# Altium schematic sheet SAM_E54_Xplained_Pro_Connectors.SchDoc: Extension connectors
size A3; Organization: Microchip Norway; Address1: Vestre Rosten 79; Address2: N-7075 TILLER; Address3: NORWAY; DocumentNumber: A09-2748; Revision: 5; SheetNumber: 5; SheetTotal: 13; DrawnBy: Microchip Norway; Engineer: HN; PageSetup: Record=PageOptions|CenterHorizontal=True|CenterVertical=True|PrintScale=1.01|XCorrection=1.00|YCorrection=1.00|PrintKind=1|BorderSize=5000000|LeftOffset=0|BottomOffset=0|Orientation=2|PaperLength=1000|PaperWidth=1000|Scale=100|PaperSource=7|PrintQuality=-4|MediaType=1|DitherType=10|PaperKind=A3 (297 x 420 mm)|PrintScaleMode=1; ProjectTitle: SAM E54 Xplained Pro; PCBNumber: A08-2643; PCBRevision: 3; ProjectName: SAM E54 Xplained Pro
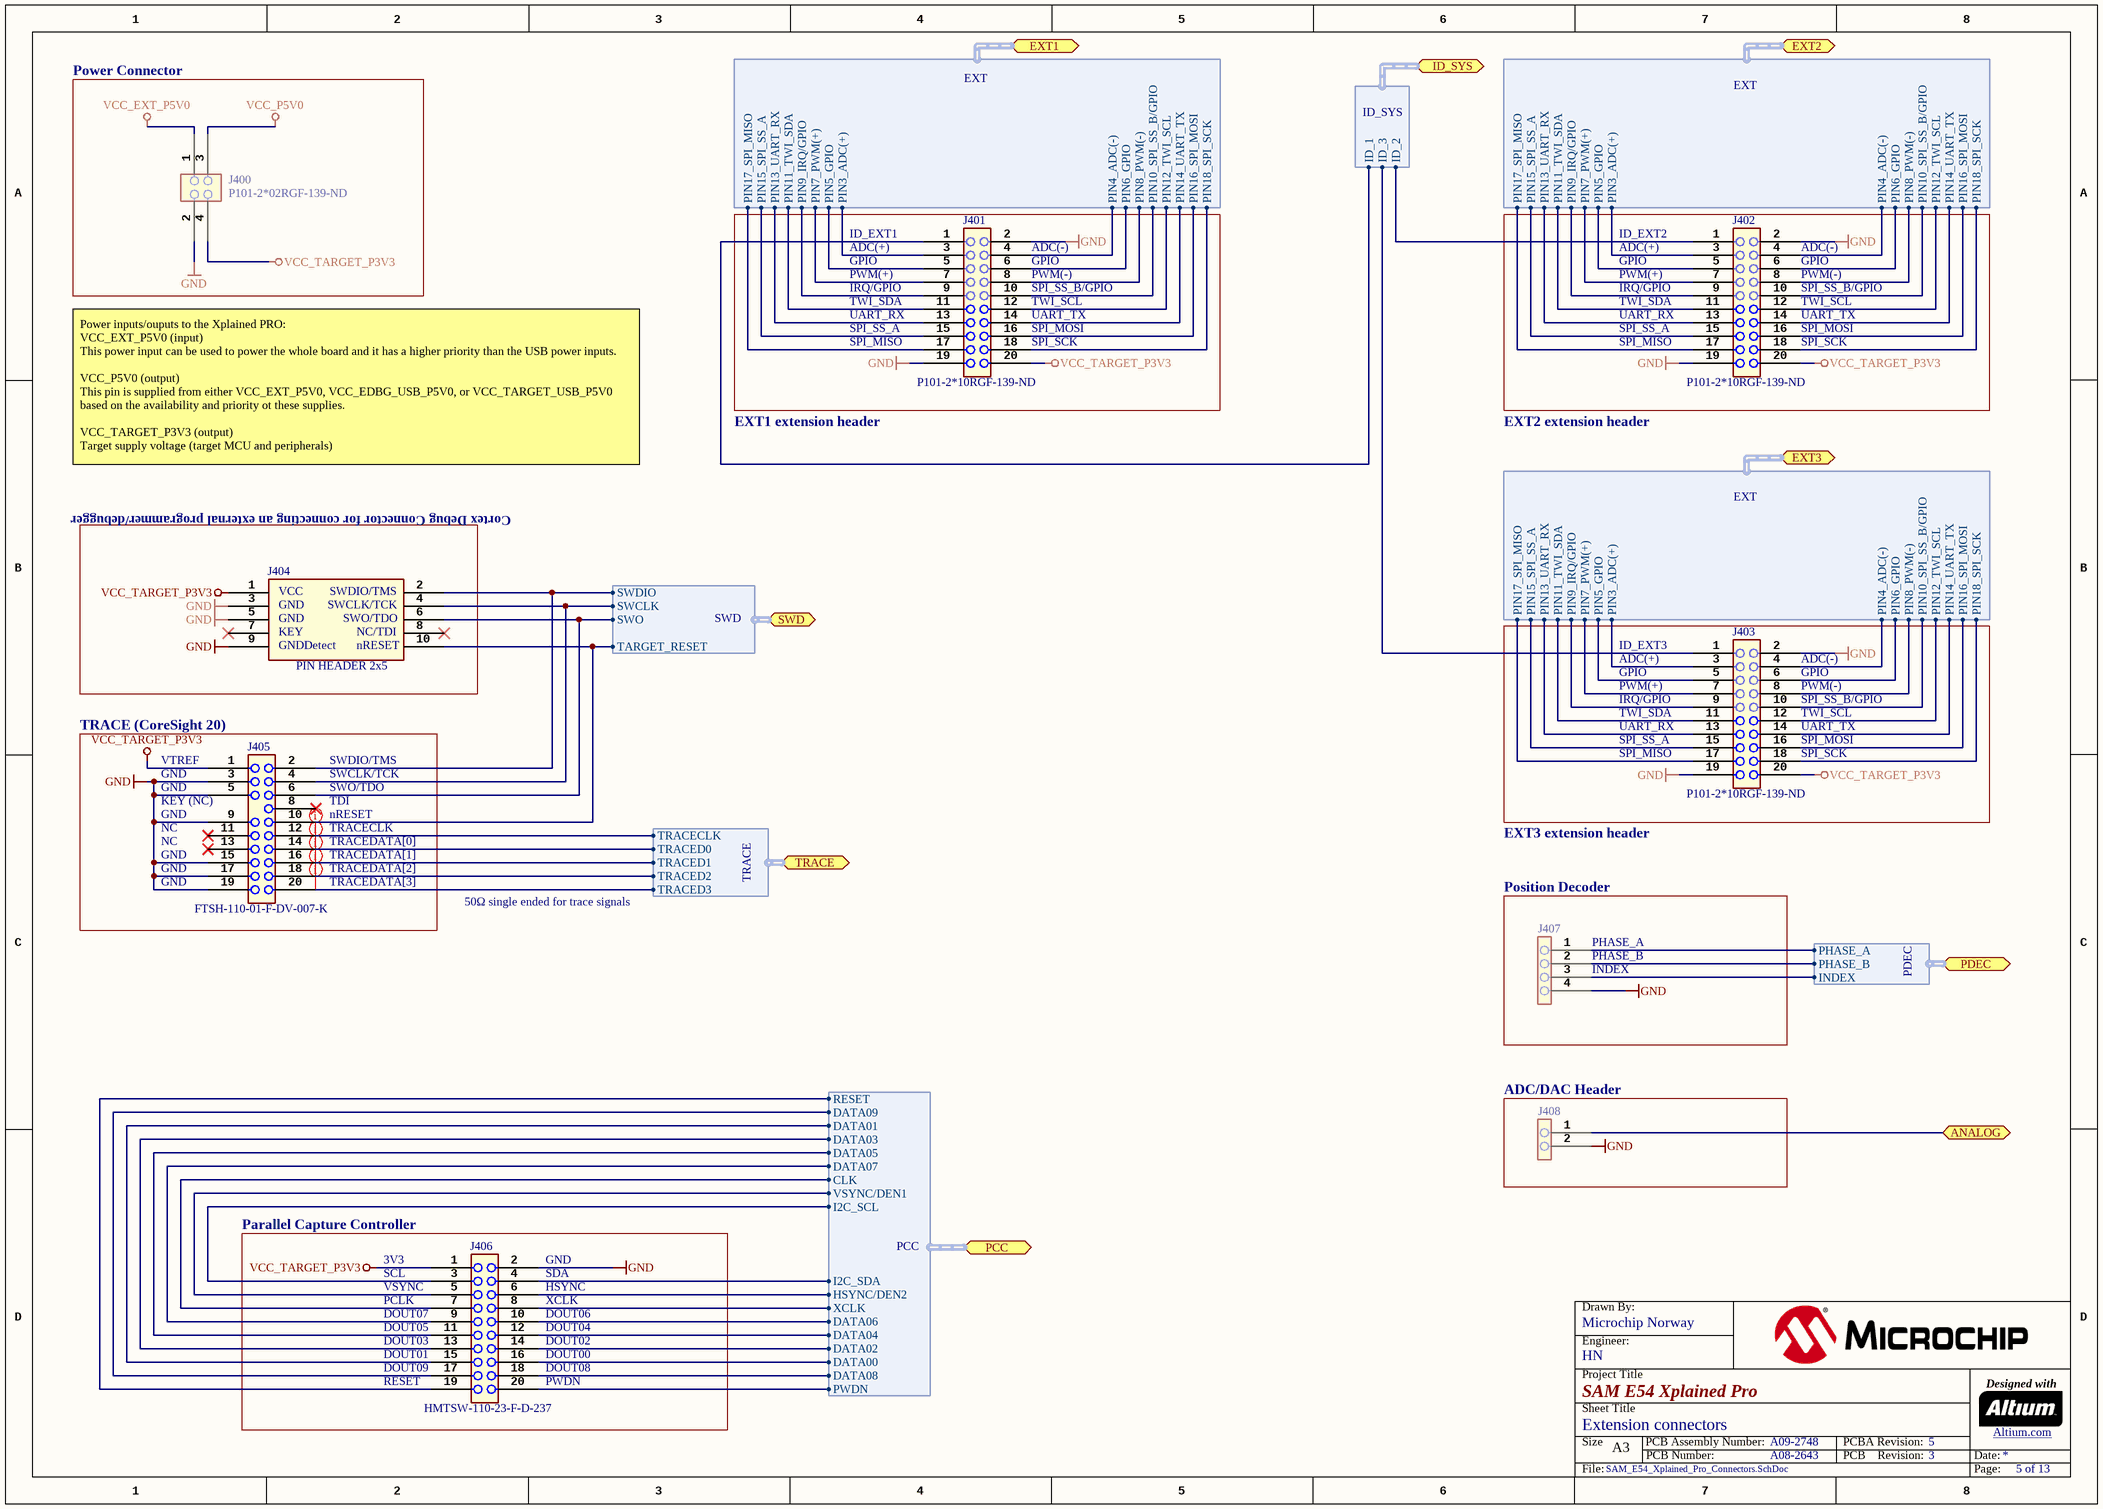
[diagram p0: SAM_E54_Xplained_Pro_Connectors.SchDoc]

## Parts
J400  value P101-2*02RGF-139-ND  [AP8-00628]
J401  value P101-2*10RGF-139-ND  [AP8-00622]
J402  value P101-2*10RGF-139-ND  [AP8-00622]
J403  value P101-2*10RGF-139-ND  [AP8-00622]
J404  value PIN HEADER 2x5  [AP8-00257]
J405  value FTSH-110-01-F-DV-007-K  [AP8-00910]
J406  value HMTSW-110-23-F-D-237  [AP8-00744]
J407  (no value)  [AP8-00176]
J408  (no value)  [AP8-00733]

## Blocks framed on the sheet
Power Connector: J400
TRACE (CoreSight 20): J405
Position Decoder: J407
ADC/DAC Header: J408
Parallel Capture Controller: J406

## Ports
ANALOG (bidir), EXT1 (harness EXT), EXT2 (harness EXT), EXT3 (harness EXT), ID_SYS (harness ID_SYS), PCC (harness PCC), PDEC (harness PDEC), SWD (harness SWD), TRACE (harness TRACE)

## Harnesses
ID_SYS: ID_1, ID_3, ID_2
EXT: PIN3_ADC(+), PIN4_ADC(-), PIN5_GPIO, PIN6_GPIO, PIN7_PWM(+), PIN8_PWM(-), PIN9_IRQ/GPIO, PIN10_SPI_SS_B/GPIO, PIN11_TWI_SDA, PIN12_TWI_SCL, PIN13_UART_RX, PIN14_UART_TX, PIN15_SPI_SS_A, PIN16_SPI_MOSI, PIN17_SPI_MISO, PIN18_SPI_SCK
TRACE: TRACECLK, TRACED0, TRACED1, TRACED2, TRACED3
SWD: SWCLK, SWDIO, TARGET_RESET, SWO
PCC: CLK, DATA00, DATA01, DATA02, DATA03, DATA04, DATA05, DATA06, DATA07, DATA08, DATA09, HSYNC/DEN2, I2C_SCL, I2C_SDA, PWDN, RESET, VSYNC/DEN1, XCLK
PDEC: PHASE_A, PHASE_B, INDEX

## Nets
GND: J400.2 J401.2 J401.19 J402.2 J402.19 J403.2 J403.19 J404.3 J404.5 J404.9 J405.3 J405.5 J405.9 J405.15 J405.17 J405.19 J406.2 J407.4 J408.2
VCC_EXT_P5V0: J400.1
VCC_P5V0: J400.3
VCC_TARGET_P3V3: J400.4 J401.20 J402.20 J403.20 J404.1 J405.1 J406.1
ANALOG: J408.1 ; port ANALOG
NetJ401_1: J401.1 ; port ID_SYS.ID_1
NetJ401_3: J401.3 ; port EXT1.PIN3_ADC(+)
NetJ401_4: J401.4 ; port EXT1.PIN4_ADC(-)
NetJ401_5: J401.5 ; port EXT1.PIN5_GPIO
NetJ401_6: J401.6 ; port EXT1.PIN6_GPIO
NetJ401_7: J401.7 ; port EXT1.PIN7_PWM(+)
NetJ401_8: J401.8 ; port EXT1.PIN8_PWM(-)
NetJ401_9: J401.9 ; port EXT1.PIN9_IRQ/GPIO
NetJ401_10: J401.10 ; port EXT1.PIN10_SPI_SS_B/GPIO
NetJ401_11: J401.11 ; port EXT1.PIN11_TWI_SDA
NetJ401_12: J401.12 ; port EXT1.PIN12_TWI_SCL
NetJ401_13: J401.13 ; port EXT1.PIN13_UART_RX
NetJ401_14: J401.14 ; port EXT1.PIN14_UART_TX
NetJ401_15: J401.15 ; port EXT1.PIN15_SPI_SS_A
NetJ401_16: J401.16 ; port EXT1.PIN16_SPI_MOSI
NetJ401_17: J401.17 ; port EXT1.PIN17_SPI_MISO
NetJ401_18: J401.18 ; port EXT1.PIN18_SPI_SCK
NetJ402_1: J402.1 ; port ID_SYS.ID_2
NetJ402_3: J402.3 ; port EXT2.PIN3_ADC(+)
NetJ402_4: J402.4 ; port EXT2.PIN4_ADC(-)
NetJ402_5: J402.5 ; port EXT2.PIN5_GPIO
NetJ402_6: J402.6 ; port EXT2.PIN6_GPIO
NetJ402_7: J402.7 ; port EXT2.PIN7_PWM(+)
NetJ402_8: J402.8 ; port EXT2.PIN8_PWM(-)
NetJ402_9: J402.9 ; port EXT2.PIN9_IRQ/GPIO
NetJ402_10: J402.10 ; port EXT2.PIN10_SPI_SS_B/GPIO
NetJ402_11: J402.11 ; port EXT2.PIN11_TWI_SDA
NetJ402_12: J402.12 ; port EXT2.PIN12_TWI_SCL
NetJ402_13: J402.13 ; port EXT2.PIN13_UART_RX
NetJ402_14: J402.14 ; port EXT2.PIN14_UART_TX
NetJ402_15: J402.15 ; port EXT2.PIN15_SPI_SS_A
NetJ402_16: J402.16 ; port EXT2.PIN16_SPI_MOSI
NetJ402_17: J402.17 ; port EXT2.PIN17_SPI_MISO
NetJ402_18: J402.18 ; port EXT2.PIN18_SPI_SCK
NetJ403_1: J403.1 ; port ID_SYS.ID_3
NetJ403_3: J403.3 ; port EXT3.PIN3_ADC(+)
NetJ403_4: J403.4 ; port EXT3.PIN4_ADC(-)
NetJ403_5: J403.5 ; port EXT3.PIN5_GPIO
NetJ403_6: J403.6 ; port EXT3.PIN6_GPIO
NetJ403_7: J403.7 ; port EXT3.PIN7_PWM(+)
NetJ403_8: J403.8 ; port EXT3.PIN8_PWM(-)
NetJ403_9: J403.9 ; port EXT3.PIN9_IRQ/GPIO
NetJ403_10: J403.10 ; port EXT3.PIN10_SPI_SS_B/GPIO
NetJ403_11: J403.11 ; port EXT3.PIN11_TWI_SDA
NetJ403_12: J403.12 ; port EXT3.PIN12_TWI_SCL
NetJ403_13: J403.13 ; port EXT3.PIN13_UART_RX
NetJ403_14: J403.14 ; port EXT3.PIN14_UART_TX
NetJ403_15: J403.15 ; port EXT3.PIN15_SPI_SS_A
NetJ403_16: J403.16 ; port EXT3.PIN16_SPI_MOSI
NetJ403_17: J403.17 ; port EXT3.PIN17_SPI_MISO
NetJ403_18: J403.18 ; port EXT3.PIN18_SPI_SCK
NetJ404_2: J404.2 J405.2 ; port SWD.SWDIO
NetJ404_4: J404.4 J405.4 ; port SWD.SWCLK
NetJ404_6: J404.6 J405.6 ; port SWD.SWO
NetJ404_10: J404.10 J405.10 ; port SWD.TARGET_RESET
NetJ405_12: J405.12 ; port TRACE.TRACECLK
NetJ405_14: J405.14 ; port TRACE.TRACED0
NetJ405_16: J405.16 ; port TRACE.TRACED1
NetJ405_18: J405.18 ; port TRACE.TRACED2
NetJ405_20: J405.20 ; port TRACE.TRACED3
NetJ406_3: J406.3 ; port PCC.I2C_SCL
NetJ406_4: J406.4 ; port PCC.I2C_SDA
NetJ406_5: J406.5 ; port PCC.VSYNC/DEN1
NetJ406_6: J406.6 ; port PCC.HSYNC/DEN2
NetJ406_7: J406.7 ; port PCC.CLK
NetJ406_8: J406.8 ; port PCC.XCLK
NetJ406_9: J406.9 ; port PCC.DATA07
NetJ406_10: J406.10 ; port PCC.DATA06
NetJ406_11: J406.11 ; port PCC.DATA05
NetJ406_12: J406.12 ; port PCC.DATA04
NetJ406_13: J406.13 ; port PCC.DATA03
NetJ406_14: J406.14 ; port PCC.DATA02
NetJ406_15: J406.15 ; port PCC.DATA01
NetJ406_16: J406.16 ; port PCC.DATA00
NetJ406_17: J406.17 ; port PCC.DATA09
NetJ406_18: J406.18 ; port PCC.DATA08
NetJ406_19: J406.19 ; port PCC.RESET
NetJ406_20: J406.20 ; port PCC.PWDN
NetJ407_1: J407.1 ; port PDEC.PHASE_A
NetJ407_2: J407.2 ; port PDEC.PHASE_B
NetJ407_3: J407.3 ; port PDEC.INDEX

Not connected (* = marked no-connect by the designer): J404 7* 8*; J405 8* 11* 13*

## Layout directives
net class TRACE: NetJ405_12, NetJ405_14, NetJ405_16, NetJ405_18, NetJ405_20

## Notes on the sheet
- ID_EXT1
- ID_EXT2
- ADC(+)
- GPIO
- PWM(+)
- IRQ/GPIO
- TWI_SDA
- UART_RX
- (near J401) ADC(-)
- (near J401) GPIO
- (near J401) PWM(-)
- (near J401) SPI_SS_B/GPIO
- (near J401) TWI_SCL
- (near J401) UART_TX
- (near J402) ADC(-)
- (near J402) GPIO
- (near J402) PWM(-)
- (near J402) SPI_SS_B/GPIO
- (near J402) TWI_SCL
- (near J402) UART_TX
- SPI_SS_A
- SPI_MISO
- (near J401) SPI_MOSI
- (near J401) SPI_SCK
- (near J402) SPI_MOSI
- (near J402) SPI_SCK
- EXT1 extension header
- EXT2 extension header
- Power inputs/ouputs to the Xplained PRO:
  VCC_EXT_P5V0 (input)
  This power input can be used to power the whole board and it has a higher priority than the USB power inputs.
  VCC_P5V0 (output)
  This pin is supplied from either VCC_EXT_P5V0, VCC_EDBG_USB_P5V0, or VCC_TARGET_USB_P5V0 based on the availability and priority ot these supplies.
  VCC_TARGET_P3V3 (output)
  Target supply voltage (target MCU and peripherals)
- Cortex Debug Connector for connecting an external programmer/debugger
- ID_EXT3
- (near J403) ADC(-)
- (near J403) GPIO
- (near J403) PWM(-)
- (near J403) SPI_SS_B/GPIO
- (near J403) TWI_SCL
- VTREF
- GND
- SWDIO/TMS
- SWCLK/TCK
- (near J403) UART_TX
- (near J403) SPI_MOSI
- (near J403) SPI_SCK
- (near J405) KEY (NC)
- NC
- TRACEDATA[1]
- TDI
- SWO/TDO
- nRESET
- TRACEDATA[0]
- TRACECLK
- EXT3 extension header
- TRACEDATA[2]
- TRACEDATA[3]
- 50Ω single ended for trace signals
- (near J407) PHASE_A
- (near J407) PHASE_B
- (near J407) INDEX
- 3V3
- (near J406) GND
- SCL
- VSYNC
- PCLK
- (near J406) DOUT07
- (near J406) HSYNC
- (near J406) SDA
- (near J406) XCLK
- (near J406) DOUT06
- (near J406) DOUT01
- (near J406) DOUT03
- (near J406) DOUT05
- (near J406) DOUT09
- RESET
- (near J406) DOUT00
- (near J406) DOUT02
- (near J406) DOUT04
- (near J406) DOUT08
- (near J406) PWDN
- Drawn By:
- Project Title
- Engineer:
- Designed with
- Sheet Title
- Size
- A3
- PCB Number:
- PCB Assembly Number:
- PCBA Revision:
- PCB    Revision:
- Date:
- Altium.com <http://go.altium.com/MicrochipLandingPage_Evaluation.html>
- File:
- Page:
- (in symbol A08-0385) VCC; SWDIO/TMS; GND; SWCLK/TCK; SWO/TDO; KEY; NC/TDI; GNDDetect; nRESET

## Library data of the parts
J400 = A08-1519: Pin header, 2x2, Right Angle, 2.54mm, THT, Pin In Paste; PartGroup: Mechanical devices,Connectors,Pin headers; Manufacturer: Pro-data International Corp; AN: A08-1519; Height: 5,07999992370605; MPN: P101-2*02RGF-139-ND
J401-J403 = A08-1513: Pin header, 2x10, Right Angle, 2.54mm, THM, Pin In Paste; PartGroup: Mechanical devices,Connectors,Pin headers; Manufacturer: Pro-data International Corp; AN: A08-1513; MPN: P101-2*10RGF-139-ND
J404 = A08-0385: 2x5 pin header, 1.27mm pitch, THM; PartGroup: Mechanical devices,Connectors,Pin headers; Manufacturer: Garry; MPN: 176-2-010-0-T-XS0-0730; AN: A08-0385; Height: 7,30000019073486
J405 = A08-2290: SAMTEC FTSH series 50-mil header, shrouded, pin 7 removed, SMD; PartGroup: Mechanical devices,Connectors,Pin headers; TemperatureRange: -55Â°C to +125Â°C; AN: A08-2290; Height: 6,1100001335144; Manufacturer: SAMTEC; MPN: FTSH-110-01-F-DV-007-K
J406 = A08-1801: 2x10 pin header, 2.54mm pitch, Pin-in-Paste THM, 1mm hole; PartGroup: Mechanical devices,Connectors,Pin headers; Manufacturer: SAMTEC; AN: A08-1801; MPN: HMTSW-110-23-F-D-237; Height: 6,09999990463257
J407 = A08-1653: 1x4 pin header, 2.54mm pitch, Pin-in-Paste THM; PartGroup: Mechanical devices,Connectors,Pin headers; Manufacturer: SAMTEC; Value: HMTSW-104-23-F-S-237; TemperatureRange: - 55 ï¿½C to + 125 ï¿½C; AN: A08-1653; Height: 6,09999990463257; MPN: HMTSW-104-23-F-S-237
J408 = A08-1754: 1x2 pin header, 2.54mm pitch, Pin-in-Paste THM; PartGroup: Mechanical devices,Connectors,Pin headers; Manufacturer: SAMTEC; Value: HMTSW-102-23-F-S-237; TemperatureRange: - 55 deg C to + 125 deg C; AN: A08-1754; Height: 6,09999990463257; MPN: HMTSW-102-23-F-S-237